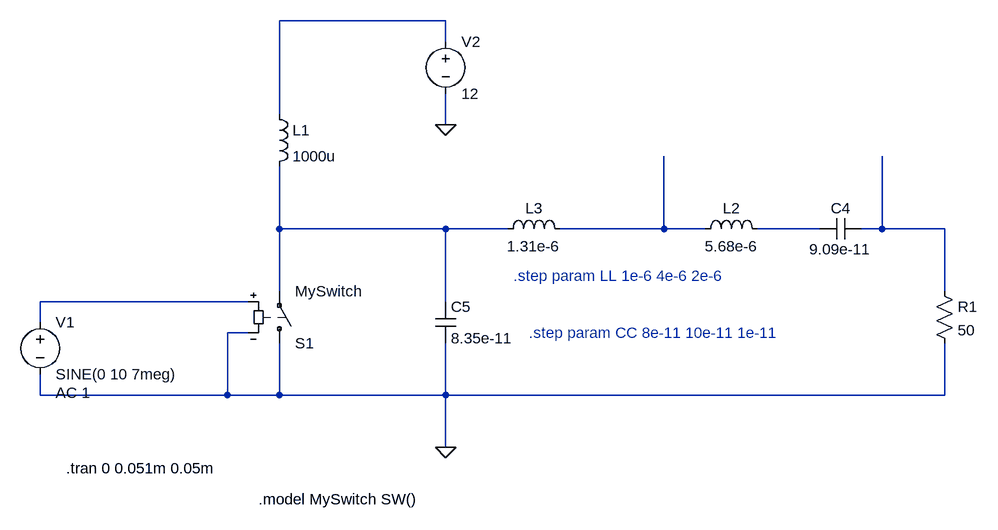
[diagram p0: schematic E-classAMP.asc]
E-classAMP.asc, the LTspice schematic file:
Version 4
SHEET 1 1544 680
WIRE -560 -256 -816 -256
WIRE -560 -224 -560 -256
WIRE -816 -112 -816 -256
WIRE -560 -96 -560 -144
WIRE -816 64 -816 -32
WIRE -560 64 -816 64
WIRE -464 64 -560 64
WIRE -224 64 -224 -48
WIRE -224 64 -384 64
WIRE -160 64 -224 64
WIRE 16 64 -80 64
WIRE 112 64 112 -48
WIRE 112 64 80 64
WIRE 208 64 112 64
WIRE -816 160 -816 64
WIRE 208 160 208 64
WIRE -864 176 -1184 176
WIRE -560 176 -560 64
WIRE -1184 208 -1184 176
WIRE -864 224 -896 224
WIRE -1184 320 -1184 288
WIRE -896 320 -896 224
WIRE -896 320 -1184 320
WIRE -816 320 -816 240
WIRE -816 320 -896 320
WIRE -560 320 -560 240
WIRE -560 320 -816 320
WIRE 208 320 208 240
WIRE 208 320 -560 320
WIRE -560 400 -560 320
FLAG -560 400 0
FLAG -560 -96 0
SYMBOL voltage -1184 192 R0
WINDOW 123 24 124 Left 2
WINDOW 39 0 0 Left 2
SYMATTR Value2 AC 1
SYMATTR InstName V1
SYMATTR Value SINE(0 10 7meg)
SYMBOL ind -832 -128 R0
SYMATTR InstName L1
SYMATTR Value 1000u
SYMBOL voltage -560 -240 R0
WINDOW 123 0 0 Left 2
WINDOW 39 0 0 Left 2
SYMATTR InstName V2
SYMATTR Value 12
SYMBOL res 192 144 R0
SYMATTR InstName R1
SYMATTR Value 50
SYMBOL cap 80 48 R90
WINDOW 0 0 32 VBottom 2
WINDOW 3 32 32 VTop 2
SYMATTR InstName C4
SYMATTR Value 9.09e-11
SYMBOL ind -64 80 M270
WINDOW 0 32 56 VTop 2
WINDOW 3 5 56 VBottom 2
SYMATTR InstName L2
SYMATTR Value 5.68e-6
SYMBOL cap -576 176 R0
SYMATTR InstName C5
SYMATTR Value 8.35e-11
SYMBOL ind -368 80 M270
WINDOW 0 32 56 VTop 2
WINDOW 3 5 56 VBottom 2
SYMATTR InstName L3
SYMATTR Value 1.31e-6
SYMBOL sw -816 256 M180
SYMATTR InstName S1
SYMATTR Value MySwitch
TEXT -1144 432 Left 2 !.tran 0 0.051m 0.05m
TEXT -848 480 Left 2 !.model MySwitch SW()
TEXT -432 224 Left 2 ;.step param CC 8e-11 10e-11 1e-11
TEXT -456 136 Left 2 ;.step param LL 1e-6 4e-6 2e-6

The netlist it stands for:
* E-classAMP.asc
V1 N006 0 SINE(0 10 7meg) AC 1
L1 N001 N002 1000u
V2 N001 0 12
R1 N005 0 50
C4 N005 N004 9.09e-11
L2 N004 N003 5.68e-6
C5 N002 0 8.35e-11
L3 N003 N002 1.31e-6
S1 0 N002 N006 0 MySwitch
.tran 0 0.051m 0.05m
.model MySwitch SW()
* .step param CC 8e-11 10e-11 1e-11
* .step param LL 1e-6 4e-6 2e-6
.backanno
.end